# Altium schematic sheet project.SchDoc
size A3 portrait
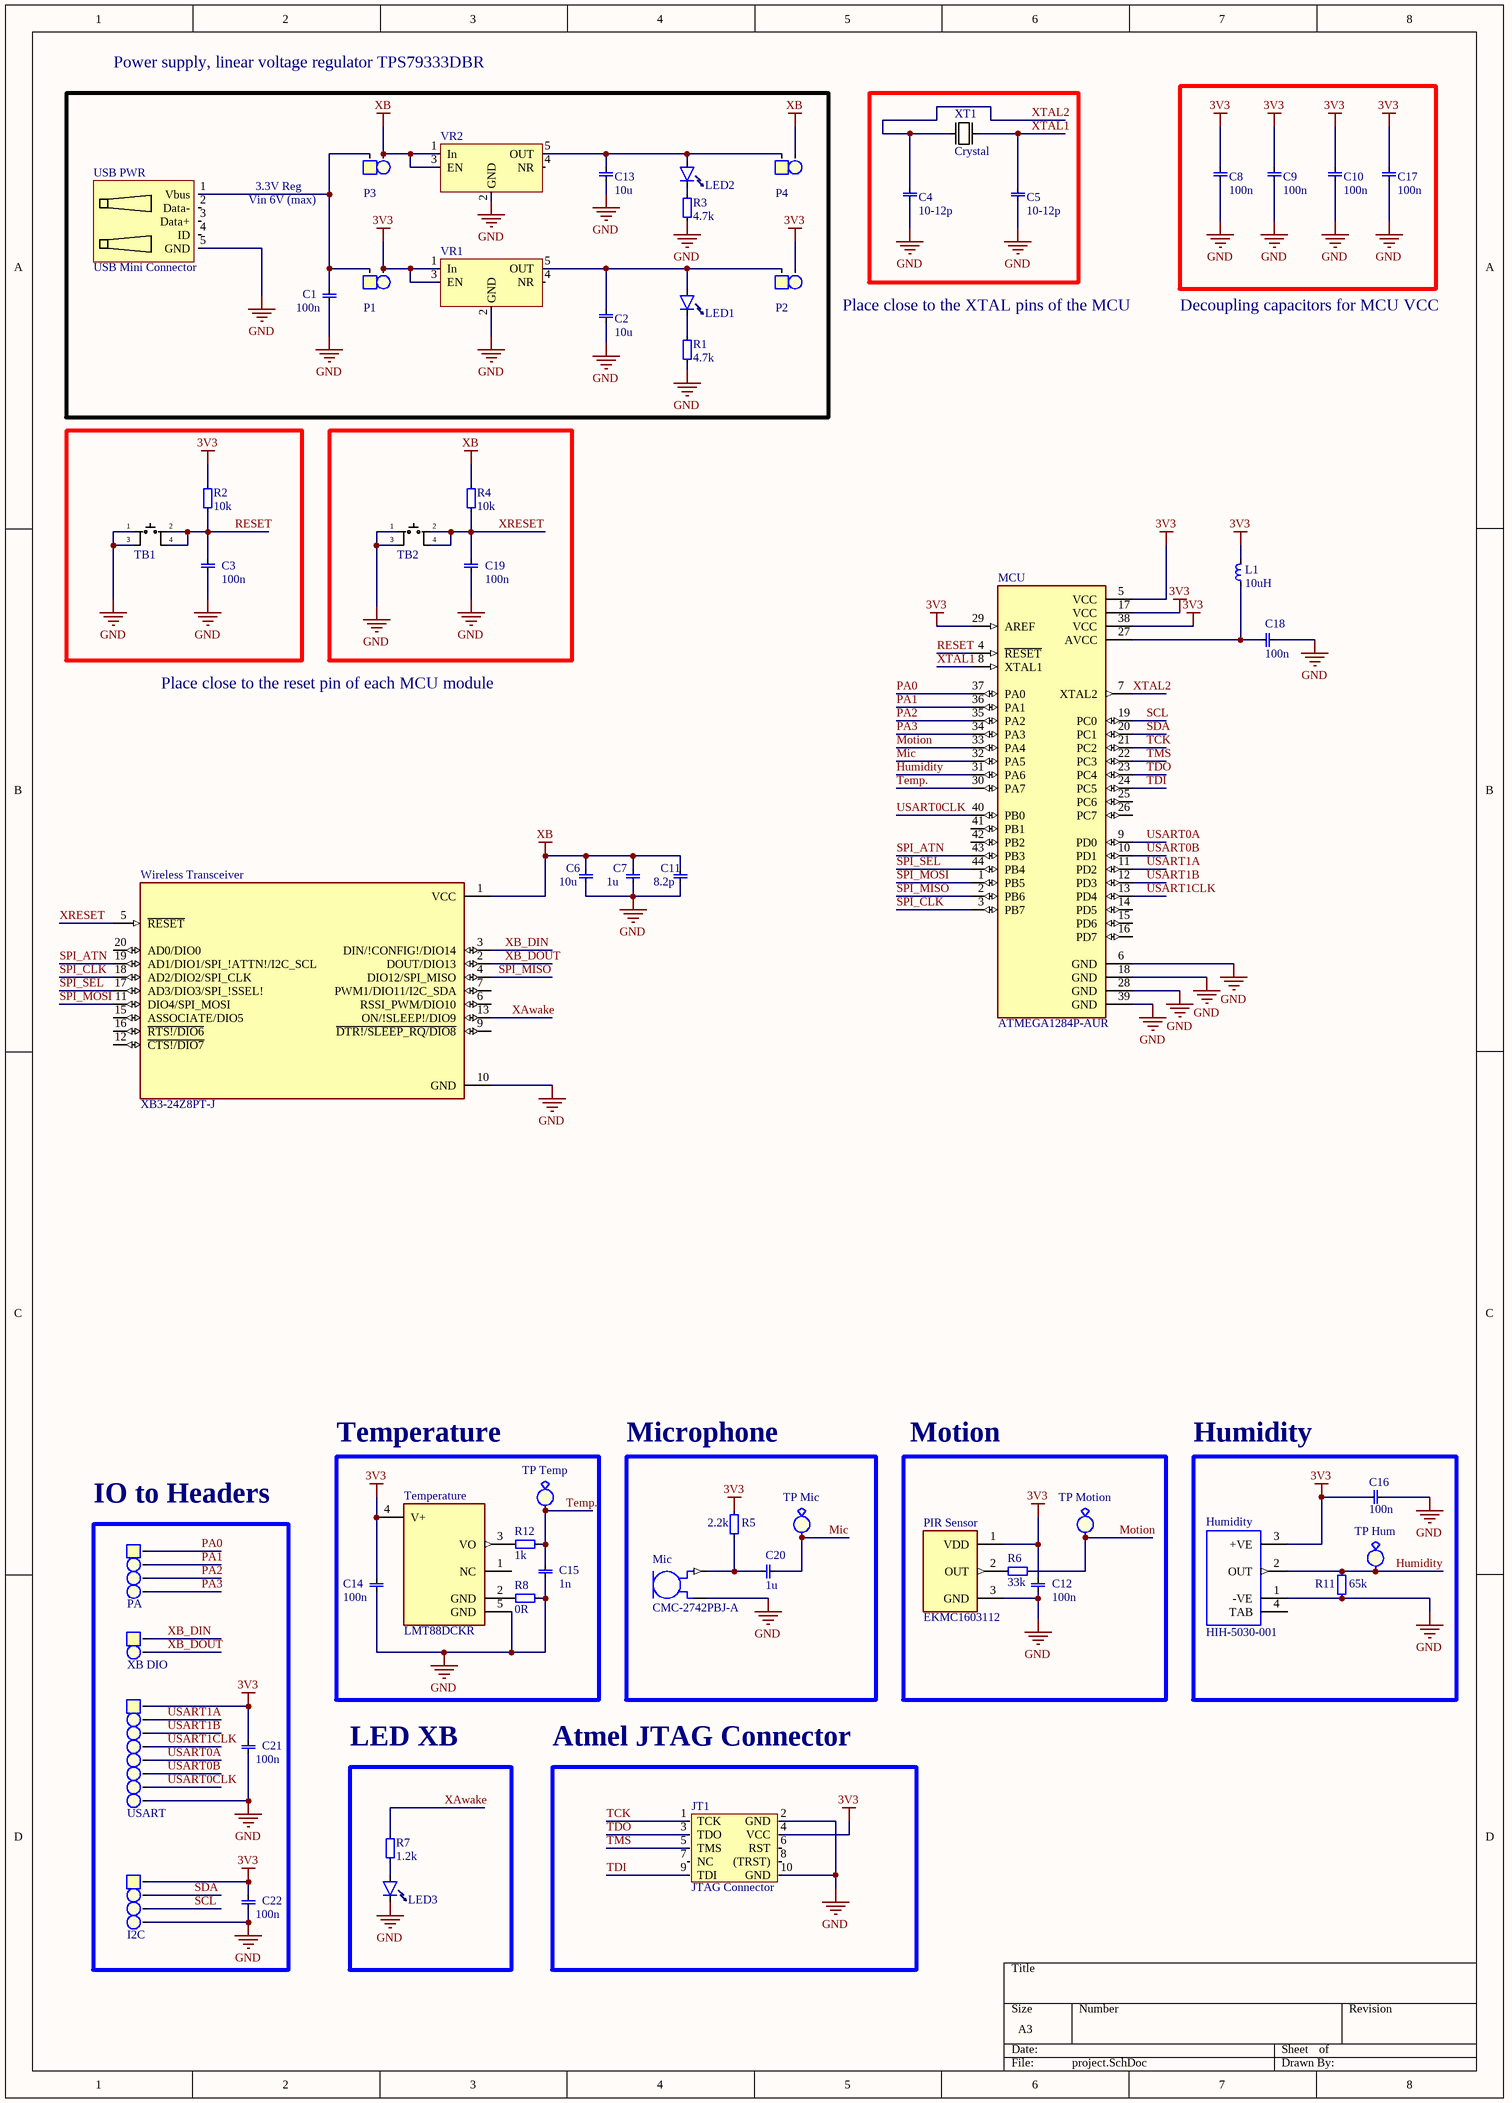
[diagram p0: project.SchDoc]

## Parts
C1  value 100n  [1206, capasitor]  (hidden comment: 1206, capacitor)
C2  value 10u  [1206, capasitor]  (hidden comment: 1206, capacitor)
C3  value 100n  [1206, capasitor]  (hidden comment: 1206, capacitor)
C4  value 10-12p  [1206, capasitor]  (hidden comment: 1206, capacitor)
C5  value 10-12p  [1206, capasitor]  (hidden comment: 1206, capacitor)
C6  value 10u  [1206, capasitor]  (hidden comment: 1206, capacitor)
C7  value 1u  [1206, capasitor]  (hidden comment: 1206, capacitor)
C8  value 100n  [1206, capasitor]  (hidden comment: 1206, capacitor)
C9  value 100n  [1206, capasitor]  (hidden comment: 1206, capacitor)
C10  value 100n  [1206, capasitor]  (hidden comment: 1206, capacitor)
C11  value 8.2p  [1206, capasitor]  (hidden comment: 1206, capacitor)
C12  value 100n  [1206, capasitor]  (hidden comment: 1206, capacitor)
C13  value 10u  [1206, capasitor]  (hidden comment: 1206, capacitor)
C14  value 100n  [1206, capasitor]  (hidden comment: 1206, capacitor)
C15  value 1n  [1206, capasitor]  (hidden comment: 1206, capacitor)
C16  value 100n  [1206, capasitor]  (hidden comment: 1206, capacitor)
C17  value 100n  [1206, capasitor]  (hidden comment: 1206, capacitor)
C18  value 100n  [1206, capasitor]  (hidden comment: 1206, capacitor)
C19  value 100n  [1206, capasitor]  (hidden comment: 1206, capacitor)
C20  value 1u  [1206, capasitor]  (hidden comment: 1206, capacitor)
C21  value 100n  [1206, capasitor]  (hidden comment: 1206, capacitor)
C22  value 100n  [1206, capasitor]  (hidden comment: 1206, capacitor)
Humidity  HIH-5030-001  [HONEYWELL_HIH-5030-001]
I2C  4x1 Pin Header  [padFour_L]  (value not drawn)
JT1  JTAG Connector  [Atmel_JTAG]
L1  value 10uH  [1812, coil]  (hidden comment: Coil)
LED1  0805, LED  [0805_led]  (value not drawn)
LED2  0805, LED  [0805_led]  (value not drawn)
LED3  0805, LED  [0805_led]  (value not drawn)
MCU  ATMEGA1284P-AUR  [QFP80P1200X1200X120-44N]
Mic  CMC-2742PBJ-A  [CUI_CMC-2742PBJ-A]
P1  1x2 Pin Header  [1x2HEADER]  (value not drawn)
P2  1x2 Pin Header  [1x2HEADER]  (value not drawn)
P3  1x2 Pin Header  [1x2HEADER]  (value not drawn)
P4  1x2 Pin Header  [1x2HEADER]  (value not drawn)
PA  4x1 Pin Header  [padFour_L]  (value not drawn)
PIR_Sensor  EKMC1603112  [TO254P2200H2020-3]
R1  value 4.7k  [1206]  (hidden comment: 1206, resistor)
R2  value 10k  [1206]  (hidden comment: 1206, resistor)
R3  value 4.7k  [1206]  (hidden comment: 1206, resistor)
R4  value 10k  [1206]  (hidden comment: 1206, resistor)
R5  value 2.2k  [1206]  (hidden comment: 1206, resistor)
R6  value 33k  [1206]  (hidden comment: 1206, resistor)
R7  value 1.2k  [1206]  (hidden comment: 1206, resistor)
R8  value 0R  [1206]  (hidden comment: 1206, resistor)
R11  value 65k  [1206]  (hidden comment: 1206, resistor)
R12  value 1k  [1206]  (hidden comment: 1206, resistor)
TB1  Tactile Button  [Button smd]  (value not drawn)
TB2  Tactile Button  [Button smd]  (value not drawn)
Temperature  LMT88DCKR  [SOT65P210X110-5N]
TP_Hum  Test Point  [testPoint]  (value not drawn)
TP_Mic  Test Point  [testPoint]  (value not drawn)
TP_Motion  Test Point  [testPoint]  (value not drawn)
TP_Temp  Test Point  [testPoint]  (value not drawn)
USART  1x8 Pin Header  [1x8 Pin HEader]  (value not drawn)
USB_PWR  USB Mini Connector  [USB Mini TH]
VR1  3.3V Reg  Input Voltage: Vin 6V (max)  [SOT23-5]
VR2  (no value)  [SOT23-5]
Wireless_Transceiver  XB3-24Z8PT-J  [XCVR_XB3-24Z8PT-J]
XB_DIO  1x2 Pin Header  [padtwo_L]  (value not drawn)
XT1  value Crystal  [XTAL_SMD_LP]  (hidden comment: XTAL TXC 7A)

## Blocks framed on the sheet
Temperature: C14 C15 R8 R12 Temperature TP_Temp
Microphone: C20 Mic R5 TP_Mic
Motion: C12 PIR_Sensor R6 TP_Motion
Humidity: C16 Humidity R11 TP_Hum
IO to Headers: C21 C22 I2C PA USART XB_DIO
LED XB: LED3 R7
Atmel JTAG Connector: JT1

## Nets
3V3: C8.1 C9.1 C10.1 C12.1 C14.1 C16.1 C17.1 C21.1 C22.1 Humidity.3(+VE) I2C.1 JT1.4(VCC) L1.1 MCU.5(VCC) MCU.17(VCC) MCU.29(AREF) MCU.38(VCC) P1.2 P2.2 PIR_Sensor.1(VDD) R2.0 R5.0 Temperature.4(V+) USART.1 VR1.1(In) VR1.3(EN)
GND: C1.0 C2.0 C3.0 C4.0 C5.0 C6.0 C7.0 C8.0 C9.0 C10.0 C11.0 C12.0 C13.0 C14.0 C15.0 C16.0 C17.0 C18.0 C19.0 C21.0 C22.0 Humidity.1(-VE) I2C.4 JT1.2(GND) JT1.10(GND) LED3.0(Cathode) MCU.6(GND) MCU.18(GND) MCU.28(GND) MCU.39(GND) Mic.GND PIR_Sensor.3(GND) R1.1 R3.1 R8.1 R11.0 TB1.1 TB1.3 TB2.1 TB2.3 Temperature.5(GND) USART.8 USB_PWR.5(GND) VR1.2(GND) VR2.2(GND) Wireless_Transceiver.10(GND)
XB: C6.1 C7.1 C11.1 P3.2 P4.2 R4.0 VR2.1(In) VR2.3(EN) Wireless_Transceiver.1(VCC)
Humidity: Humidity.2(OUT) MCU.31(PA6) R11.1 TP_Hum.0
Mic: C20.0 MCU.32(PA5) TP_Mic.0
Motion: MCU.33(PA4) R6.1 TP_Motion.0
PA0: MCU.37(PA0) PA.1
PA1: MCU.36(PA1) PA.2
PA2: MCU.35(PA2) PA.3
PA3: MCU.34(PA3) PA.4
RESET: C3.1 MCU.4(~{RESET}) R2.1 TB1.2 TB1.4
SCL: I2C.3 MCU.19(PC0)
SDA: I2C.2 MCU.20(PC1)
SPI_ATN: MCU.43(PB3) Wireless_Transceiver.19(AD1/DIO1/SPI_!ATTN!/I2C_SCL)
SPI_CLK: MCU.3(PB7) Wireless_Transceiver.18(AD2/DIO2/SPI_CLK)
SPI_MISO: MCU.2(PB6) Wireless_Transceiver.4(DIO12/SPI_MISO)
SPI_MOSI: MCU.1(PB5) Wireless_Transceiver.11(DIO4/SPI_MOSI)
SPI_SEL: MCU.44(PB4) Wireless_Transceiver.17(AD3/DIO3/SPI_!SSEL!)
TCK: JT1.1(TCK) MCU.21(PC2)
TDI: JT1.9(TDI) MCU.24(PC5)
TDO: JT1.3(TDO) MCU.23(PC4)
Temp.: C15.1 MCU.30(PA7) R12.1 TP_Temp.0
TMS: JT1.5(TMS) MCU.22(PC3)
USART0A: MCU.9(PD0) USART.5
USART0B: MCU.10(PD1) USART.6
USART0CLK: MCU.40(PB0) USART.7
USART1A: MCU.11(PD2) USART.2
USART1B: MCU.12(PD3) USART.3
USART1CLK: MCU.13(PD4) USART.4
XAwake: R7.0 Wireless_Transceiver.13(ON/!SLEEP!/DIO9)
XB_DIN: Wireless_Transceiver.3(DIN/!CONFIG!/DIO14) XB_DIO.1
XB_DOUT: Wireless_Transceiver.2(DOUT/DIO13) XB_DIO.2
XRESET: C19.1 R4.1 TB2.2 TB2.4 Wireless_Transceiver.5(~{RESET})
XTAL1: C5.1 MCU.8(XTAL1) XT1.2
XTAL2: C4.1 MCU.7(XTAL2) XT1.1
NetC1_1: C1.1 P1.1 P3.1 USB_PWR.1(Vbus)
NetC2_1: C2.1 LED1.1 P2.1 VR1.5(OUT)
NetC13_1: C13.1 LED2.1 P4.1 VR2.5(OUT)
NetC18_1: C18.1 L1.2 MCU.27(AVCC)
NetC20_1: C20.1 Mic.OUT R5.1
NetLED1_0: LED1.0(Cathode) R1.0
NetLED2_0: LED2.0(Cathode) R3.0
NetLED3_1: LED3.1 R7.1
NetPIR_Sensor_2: PIR_Sensor.2(OUT) R6.0
NetR8_0: R8.0 Temperature.2(GND)
NetR12_0: R12.0 Temperature.3(VO)

Not connected (* = marked no-connect by the designer): Humidity 4(TAB); JT1 6(RST) 7(NC) 8((TRST)); MCU 14(PD5) 15(PD6) 16(PD7) 25(PC6) 26(PC7) 41(PB1) 42(PB2); Temperature 1(NC); USB_PWR 2(Data-) 3(Data+) 4(ID); VR1 4(NR); VR2 4(NR); Wireless_Transceiver 6(RSSI_PWM/DIO10) 7(PWM1/DIO11/I2C_SDA) 9(~{DTR!/SLEEP_RQ/DIO8}) 12(~{CTS!/DIO7}) 15(ASSOCIATE/DIO5) 16(~{RTS!/DIO6}) 20(AD0/DIO0)

## Notes on the sheet
- Power supply, linear voltage regulator TPS79333DBR
- (near P2) Place close to the XTAL pins of the MCU
- Decoupling capacitors for MCU VCC
- Place close to the reset pin of each MCU module

## Library data of the parts
Humidity = HIH-5030-001: Humidity Temperature Sensor 0 ~ 100% RH Analog Voltage Â±3% RH 5s Surface Mount; MF: Honeywell Sensing; Value: *; MP: HIH-5030-001; Package: Housed Sensor Honeywell Sensing; SnapEDA_Link: https://www.snapeda.com/parts/HIH-5030-001/Honeywell%20Sensing%20and%20Productivity%20Solutions/view-part/269223/?ref=snap; Digi-Key_Part_Number: 480-3294-1-ND; Digi-Key_Purchase_URL: https://www.digikey.com/product-detail/en/honeywell-sensing-and-productivity-solutions/HIH-5030-001/480-3294-1-ND/2061078?utm_source=snapeda&utm_medium=aggregator&utm_campaign=symbol; Digikey: 480-3294-1-ND
I2C PA = 1x4 Pin Header: 2.54 mm; Value: 4x1 Pin Header; Digikey: 732-5317-ND
JT1 = Atmel JTAG: Atmel JTAG Connector; Digikey: 609-3243-ND; Value: JTAG CONN
LED1-LED3 = 0805, LED: Value: 0805 LED
  LED1 LED2: Digikey: 475-1278-6-ND
  LED3: Digikey: 475-1410-1-ND
MCU = ATMEGA1284P-AUR: AVR AVRÂ® ATmega Microcontroller IC 8-Bit 20MHz 128KB (64K x 16) FLASH 44-TQFP (10x10); MF: Microchip; Price: None; SnapEDA_Link: https://www.snapeda.com/parts/ATMEGA1284P-AUR/Microchip/view-part/1775205/?ref=snap; MP: ATMEGA1284P-AUR; Availability: Warning; Value: *; Mouser-Purchase-URL: https://snapeda.com/shop?store=Mouser&id=1775205; Package: TQFP-44 Microchip; Digikey: ATMEGA1284P-AURTR-ND
Mic = CMC-2742PBJ-A: 6.0 mm, Omnidirectional, PCB Mount, 2.0 Vdc, Electret Condenser Microphone; Package: None; Price: None; Value: *; MP: CMC-2742PBJ-A; Availability: Unavailable; Digikey: 102-1726-ND
P1-P4 XB_DIO = 1x2 Pin Header: 2.54 mm, TH; Value: 1x2 Pin Header; Digikey: 732-5315-ND
  P1: F: *
PIR_Sensor = EKMC1603112: Sensor PIR _Passive Infrared_ 472 _12m_ 39.4' Polyethylene, Black Lens; MF: Panasonic Electric; Value: *; SnapEDA_Link: https://www.snapeda.com/parts/EKMC1603112/Panasonic%20Electric%20Works/view-part/82446/?ref=snap; Availability: Unavailable; MP: EKMC1603112; Package: - Panasonic Electric; Price: None; Digikey: 255-EKMC2609112K-ND
R1-R8 R11 R12 = 1206, resistor: Resistor
  R1 R3: Digikey: A130181CT-ND
  R2 R4: Digikey: RNCP1206FTD10K0CT-ND
  R5: Digikey: A129814CT-ND
  R6: Digikey: A129828CT-ND
  R7: Digikey: A129811CT-ND
  R8: Digikey: A140045CT-ND
  R11: Digikey: A140679CT-ND
  R12: Digikey: A130177CT-ND
TB1 TB2 = Button SMD: Tactile Switch Small Low; ELFA: 110-87-406; Value: Button SMD; Digikey: 732-7003-1-ND
Temperature = LMT88DCKR: &plusmn;4&deg;C analog output temperature sensor, with -11.77mV/&deg;C gain 5-SC70 -55 to 130; Price: None; Package: None; Availability: Unavailable; MP: LMT88DCKR; Value: *; Digikey: 296-38167-1-ND
USART = 1x8 Pin Header: 2.54 mm; Value: 1x8 Pin Header; Digikey: 732-5321-ND
VR1 VR2 = TPS79333DBR: 3.3V Reg, Ultra-Low Noise, 200 mA; Value: TPS79333DBVR; Drop Out: 102mV; Digikey: 2156-TPS79333DBVRG4Q1-ND
  VR1: Farnell: 1287689
Wireless_Transceiver = XB3-24Z8PT-J: 802.15.4 ZigbeeÂ® Transceiver Module 2.4GHz Integrated, Trace Through Hole; MF: Digi International; Value: *; Digi-Key_Purchase_URL: https://www.digikey.ch/product-detail/en/digi/XB3-24Z8PT-J/602-2188-ND/8130934?utm_source=snapeda&utm_medium=aggregator&utm_campaign=symbol; MP: XB3-24Z8PT-J; Package: Module Digi International; SnapEDA_Link: https://www.snapeda.com/parts/XB3-24Z8PT-J/Digi%20International/view-part/2751315/?ref=snap; Digi-Key_Part_Number: 602-2188-ND; Digikey: 602-2188-ND
XT1 = XTAL TXC 7A: 16 MHz, SMD, 5mm x 3,2mm, 30 ppm; Farnell: 1841946; Digikey: 887-1086-2-ND
C1-C22 = 1206, capacitor
  C1 C3 C8-C10 C12 C14 C16-C19 C21 C22: Digikey: 1276-1017-1-ND
  C2 C6 C13: Digikey: 1276-6736-1-ND
  C4 C5 C11: Digikey: 1276-1083-2-ND
  C7 C20: Digikey: 1276-6737-1-ND
  C15: Digikey: 1276-1050-1-ND
L1 = Coil: Digikey: 732-4516-1-ND
TP_Hum TP_Mic TP_Motion TP_Temp = Test Point: Value: Test point; Farnell: 1702006; Digikey: 36-5001-ND
USB_PWR = USB Mini Connector: Value: USB Mini Connector; Farnell: 1125348; Digikey: A107788-ND